# EAGLE schematic javi_VCAvolumenContol_revB (EAGLE 9.6.2)
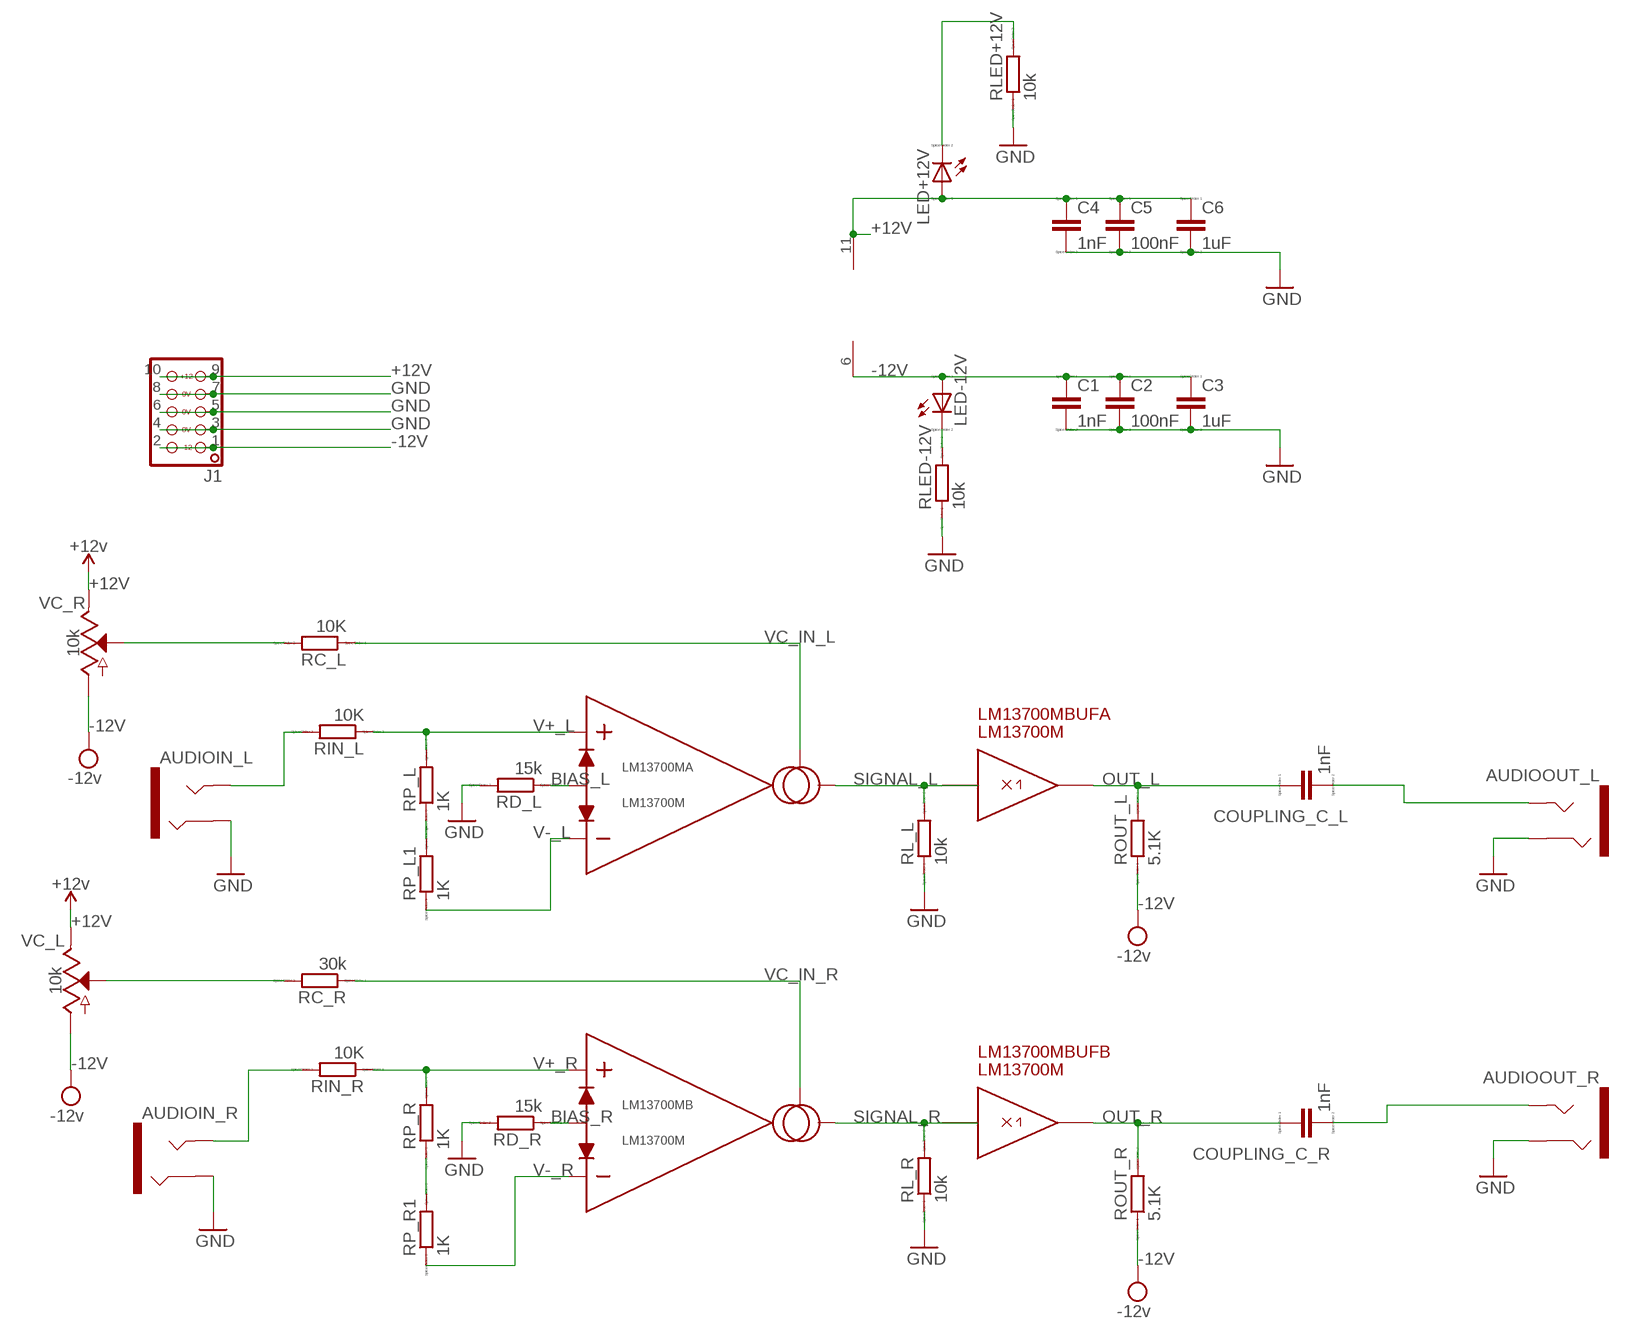
[diagram p0: schematic, sheet 1]

## Parts
AUDIOIN_L  AUDIO_JACK_TRS_0.25"_PTH_VERTICAL  [AUDIO_JACK_0.25"_TRS_PTH_VERTICAL]
AUDIOIN_R  AUDIO_JACK_TRS_0.25"_PTH_VERTICAL  [AUDIO_JACK_0.25"_TRS_PTH_VERTICAL]
AUDIOOUT_L  AUDIO_JACK_TRS_0.25"_PTH_VERTICAL  [AUDIO_JACK_0.25"_TRS_PTH_VERTICAL]
AUDIOOUT_R  AUDIO_JACK_TRS_0.25"_PTH_VERTICAL  [AUDIO_JACK_0.25"_TRS_PTH_VERTICAL]
C1  1nF  C  [C0805]
C2  100nF  C  [C0805]
C3  1uF  C  [C0805]
C4  1nF  C  [C0805]
C5  100nF  C  [C0805]
C6  1uF  C  [C0805]
COUPLING_C_L  1nF  C  [C0805]
COUPLING_C_R  1nF  C  [C0805]
J1  EUROPWR_2X05-SMD  [2X05_EUROPWR_SMD]
LED+12V  LED_E  [LED_1206]
LED-12V  LED_E  [LED_1206]
LM13700M  LM13700M  [SO16]
RC_L  10K  R  [R0805]
RC_R  30k  R  [R0805]
RD_L  15k  R  [R0805]
RD_R  15k  R  [R0805]
RIN_L  10K  R  [R0805]
RIN_R  10K  R  [R0805]
RL_L  10k  R  [R0805]
RL_R  10k  R  [R0805]
RLED+12V  10k  R  [R0805]
RLED-12V  10k  R  [R0805]
ROUT_L  5.1K  R  [R0805]
ROUT_R  5.1K  R  [R0805]
RP_L  1K  R  [R0805]
RP_L1  1K  R  [R0805]
RP_R  1K  R  [R0805]
RP_R1  1K  R  [R0805]
VC_L  10k  POTENTIOMETER-PTH-9MM-1/20W-20%  [POT-PTH-ALPS]
VC_R  10k  POTENTIOMETER-PTH-9MM-1/20W-20%  [POT-PTH-ALPS]

## Nets
+12V: C4.1 C5.1 C6.1 J1.9 J1.10 LED+12V.A LM13700M.11(PWR:VEE) VC_L.P$1(E) VC_R.P$1(E) ; supply symbol labelled +12v
-12V: C1.1 C2.1 C3.1 J1.1 J1.2 LED-12V.A LM13700M.6(PWR:VCC) ROUT_L.1 ROUT_R.1 VC_L.P$3(A) VC_R.P$3(A) ; supply symbol labelled -12v
BIAS_L: LM13700M.2(A:BIAS) RD_L.1
BIAS_R: LM13700M.15(B:BIAS) RD_R.1
GND: AUDIOIN_L.RING AUDIOIN_R.RING AUDIOOUT_L.RING AUDIOOUT_R.RING C1.2 C2.2 C3.2 C4.2 C5.2 C6.2 J1.3 J1.4 J1.5 J1.6 J1.7 J1.8 RD_L.2 RD_R.2 RL_L.1 RL_R.1 RLED+12V.1 RLED-12V.1
N$5: RP_R1.2 RP_R.1
N$11: AUDIOIN_R.TIP RIN_R.2
N$12: AUDIOOUT_L.TIP COUPLING_C_L.2
N$15: RC_R.2 VC_L.P$2(S)
N$16: RP_L1.2 RP_L.1
N$17: LED-12V.C RLED-12V.2
N$18: LED+12V.C RLED+12V.2
N$19: RC_L.2 VC_R.P$2(S)
N$20: AUDIOOUT_R.TIP COUPLING_C_R.2
N$21: AUDIOIN_L.TIP RIN_L.2
OUT_L: COUPLING_C_L.1 LM13700M.8(BUFA:OUT) ROUT_L.2
OUT_R: COUPLING_C_R.1 LM13700M.9(BUFB:OUT) ROUT_R.2
SIGNAL_L: LM13700M.5(A:IOUT) LM13700M.7(BUFA:IN) RL_L.2
SIGNAL_R: LM13700M.10(BUFB:IN) LM13700M.12(B:IOUT) RL_R.2
V+_L: LM13700M.3(A:IN+) RIN_L.1 RP_L.2
V+_R: LM13700M.14(B:IN+) RIN_R.1 RP_R.2
V-_L: LM13700M.4(A:IN-) RP_L1.1
V-_R: LM13700M.13(B:IN-) RP_R1.1
VC_IN_L: LM13700M.1(A:IABC) RC_L.1
VC_IN_R: LM13700M.16(B:IABC) RC_R.1

## Library data of the parts
AUDIOIN_L AUDIOIN_R AUDIOOUT_L AUDIOOUT_R = SparkFun-Retired:AUDIO_JACK_TRS_0.25"_PTH_VERTICAL: Audio Jack, 1/4" TRS jack, VERTICLEl, PTH, aka "Phono jack" Note, this footprint is UN-proven. It has not yet been used by SparkFun on a design.; PROD_ID: COM-11152
C1-C6 COUPLING_C_L COUPLING_C_R = eagle-ltspice:C: CAPACITOR, European symbol; SPICEMODEL: NONE; SPICEPREFIX: C
J1 = halcyonmod_Connectors:EUROPWR_2X05: 2x05 pin header
LED+12V LED-12V = eagle-ltspice:LED_E: LED Source: http://www.osram.convergy.de Source: www.luxeon.com Source: www.kingbright.com; SPICEMODEL: NONE; SPICEPREFIX: D; SPICETYPE: diode
LM13700M = OTAs:LM13700: Dual OTA with linearizing diode and output buffers - 2MHz open-loop bandwidth - Linearizing diodes reduces distortion at higher differential input voltages - Darlington output buffers enables low-impedance output LM13700 or LM13600 The LM13700 differs from the LM13600 in that the 13700's output buffers are biased independently from the transconductance amplifier, allowing superior performance in audio applications. Originally released by National Semiconductor Manufactured by Texas Instruments.
RC_L RC_R RD_L RD_R RIN_L RIN_R RL_L RL_R RLED+12V RLED-12V ROUT_L ROUT_R RP_L RP_L1 RP_R RP_R1 = eagle-ltspice:R: RESISTOR, European symbol; SPICEMODEL: NONE; SPICEPREFIX: R
VC_L VC_R = SparkFun-Resistors:POTENTIOMETER: Potentiometer (Pot) Three-terminal potentiometers, with an adjustable wiper and two adjustable resistors. A pot can be used to create a configurable voltage divider, or as a variable resistor. Variants ALPS_POT and ALPS_POT_KIT - PTH, breadboard compatible, 9mm square pots Rotary Potentiometer - Linear (10k ohm) <https://www.sparkfun.com/products/9288> (COM-09288) The KIT variant exposes copper on only one side of the PTH pad, so the part can only be assembled on one side of the PCB. Useful for beginner soldering kits.; PROD_ID: RES-09177; SF_SKU: COM-09288